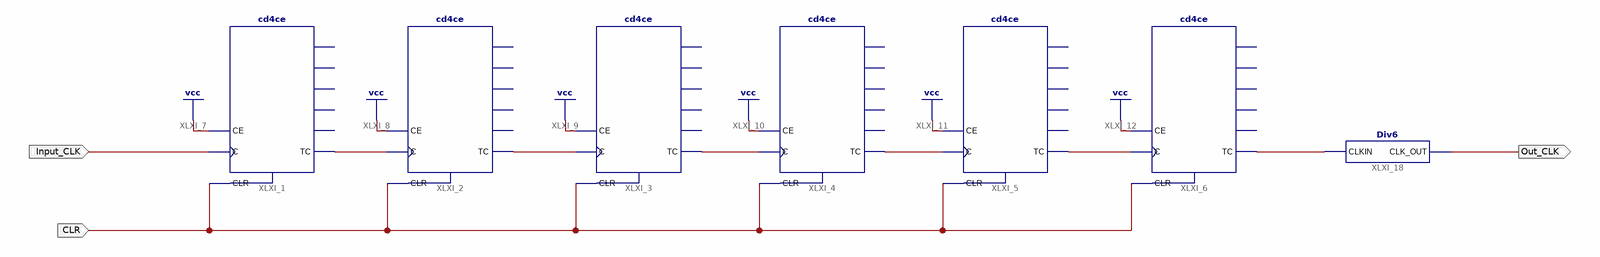
[diagram p0: schematic sheet 1]
// Xilinx ISE schematic Div6M.sch (spartan6) as structural Verilog: 7 symbols, 3 ports
module Div6M (
  input  Input_CLK,
  input  CLR,
  output Out_CLK
);

  wire XLXN_2, XLXN_3, XLXN_4, XLXN_5, XLXN_6, XLXN_7;

  cd4ce XLXI_1 (.C(Input_CLK), .CE(1'b1), .CLR(CLR), .TC(XLXN_2));  // open: CEO, Q0, Q1, Q2, Q3
  cd4ce XLXI_2 (.C(XLXN_2), .CE(1'b1), .CLR(CLR), .TC(XLXN_3));  // open: CEO, Q0, Q1, Q2, Q3
  cd4ce XLXI_3 (.C(XLXN_3), .CE(1'b1), .CLR(CLR), .TC(XLXN_4));  // open: CEO, Q0, Q1, Q2, Q3
  cd4ce XLXI_4 (.C(XLXN_4), .CE(1'b1), .CLR(CLR), .TC(XLXN_5));  // open: CEO, Q0, Q1, Q2, Q3
  cd4ce XLXI_5 (.C(XLXN_5), .CE(1'b1), .CLR(CLR), .TC(XLXN_6));  // open: CEO, Q0, Q1, Q2, Q3
  cd4ce XLXI_6 (.C(XLXN_6), .CE(1'b1), .CLR(CLR), .TC(XLXN_7));  // open: CEO, Q0, Q1, Q2, Q3
  Div6 XLXI_18 (.CLKIN(XLXN_7), .CLK_OUT(Out_CLK));
endmodule
